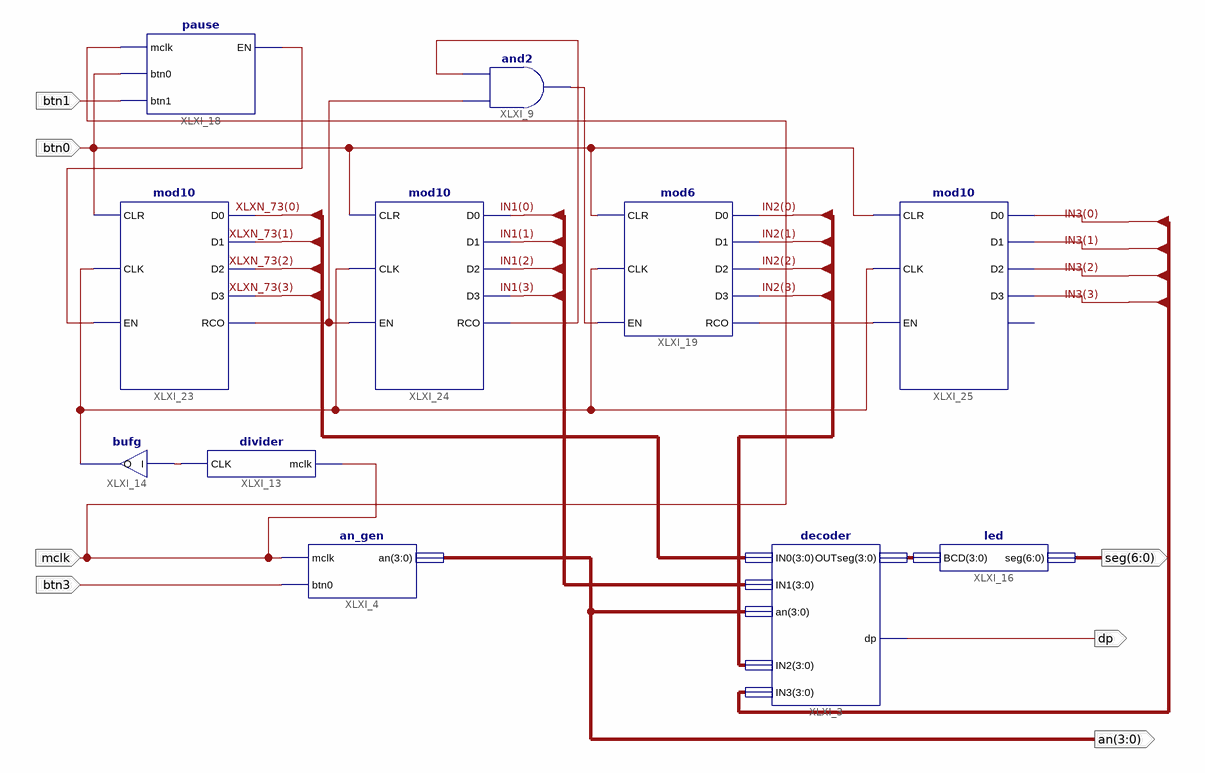
[diagram p0: schematic sheet 1]
// Xilinx ISE schematic stopwatch.sch (spartan3e) as structural Verilog: 11 symbols, 7 ports
module stopwatch (
  input  btn0,
  input  mclk,
  input  btn3,
  input  btn1,
  output [6:0] seg,
  output dp,
  output [3:0] an
);

  wire XLXN_34, XLXN_36, XLXN_94, XLXN_98, XLXN_99, XLXN_103, XLXN_107;
  wire [3:0] IN1, IN2, IN3, XLXN_1, XLXN_73;

  an_gen XLXI_4 (.mclk(mclk), .btn0(btn3), .an(an));
  and XLXI_9 (XLXN_103, XLXN_99, XLXN_34);
  decoder XLXI_3 (.IN3(IN3), .IN2(IN2), .IN1(IN1), .IN0(XLXN_73), .an(an), .dp(dp), .OUTseg(XLXN_1));
  divider XLXI_13 (.mclk(mclk), .CLK(XLXN_94));
  bufg XLXI_14 (.I(XLXN_94), .O(XLXN_98));
  led XLXI_16 (.BCD(XLXN_1), .seg(seg));
  pause XLXI_18 (.mclk(mclk), .btn0(btn0), .btn1(btn1), .EN(XLXN_107));
  mod6 XLXI_19 (
    .CLK(XLXN_98), .EN(XLXN_103), .CLR(btn0), .D1(IN2[1]), .D2(IN2[2]), .RCO(XLXN_36), .D0(IN2[0]),
    .D3(IN2[3]));
  mod10 XLXI_23 (
    .CLR(btn0), .CLK(XLXN_98), .EN(XLXN_107), .D1(XLXN_73[1]), .D2(XLXN_73[2]), .D3(XLXN_73[3]),
    .RCO(XLXN_99), .D0(XLXN_73[0]));
  mod10 XLXI_24 (
    .CLR(btn0), .CLK(XLXN_98), .EN(XLXN_99), .D1(IN1[1]), .D2(IN1[2]), .D3(IN1[3]), .RCO(XLXN_34), .D0(IN1[0]));
  mod10 XLXI_25 (
    .CLR(btn0), .CLK(XLXN_98), .EN(XLXN_36), .D1(IN3[1]), .D2(IN3[2]), .D3(IN3[3]), .D0(IN3[0]));  // open: RCO
endmodule
